# EAGLE schematic hall_sensor (EAGLE 6.5.0)
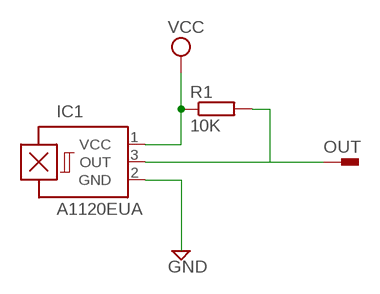
[diagram p0: schematic, sheet 1]

## Parts
IC1  A1120EUA  A1202UA  [SIP3-UA]
OUT  PIN1-2  [62221]
R1  10K  R-EU_0207/12  [0207/12]

## Nets
N$1: IC1.2(GND)
N$2: IC1.3(OUT) R1.2
VCC: IC1.1(VCC) R1.1
Unconnected: OUT.1

## Library data of the parts
IC1 = allegro:A12*?: Hall-effect bipolar switch Source: http://www.allegromicro.com/en/Products/Part_Numbers/1202/1202.pdf; OC_FARNELL: unknown; OC_NEWARK: unknown
OUT = con-faston:PIN1-2: CONN TAB FASTON BRASS .187 PCB TAB, FSSTON, DUAL STAKE, .187 SERIES Digi-Key Part Number: A24734CT-ND Source: Tyco Electronics Corporation .. ENG_CD_62221_R.pdf http://search.digikey.com/scripts/DkSearch/dksus.dll?Detail&name=A24734CT-ND; MF: TYCO ELECTRONICS; MPN: 62221-1; OC_FARNELL: unknown; OC_NEWARK: 16H2318
R1 = resistor:R-EU_: RESISTOR, European symbol